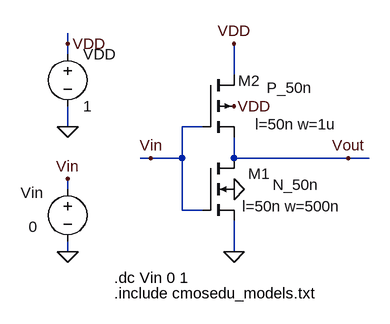
[diagram p0: schematic 1-NOT-DC.asc]
1-NOT-DC.asc, the LTspice schematic file:
Version 4
SHEET 1 1136 680
WIRE 192 -352 192 -368
WIRE 192 -336 192 -352
WIRE 448 -304 448 -352
WIRE 192 -224 192 -256
WIRE 400 -224 368 -224
WIRE 320 -176 304 -176
WIRE 368 -176 368 -224
WIRE 368 -176 320 -176
WIRE 448 -176 448 -208
WIRE 624 -176 448 -176
WIRE 656 -176 624 -176
WIRE 192 -128 192 -144
WIRE 368 -96 368 -176
WIRE 400 -96 368 -96
WIRE 192 -32 192 -48
WIRE 448 -32 448 -80
FLAG 192 -32 0
FLAG 624 -176 Vout
FLAG 192 -144 Vin
FLAG 448 -128 0
FLAG 192 -224 0
FLAG 192 -352 VDD
FLAG 448 -256 VDD
FLAG 448 -32 0
FLAG 448 -352 VDD
FLAG 320 -176 Vin
SYMBOL nmos4 400 -176 R0
WINDOW 0 104 24 Right 2
WINDOW 3 179 41 Right 2
WINDOW 123 213 74 Right 2
SYMATTR InstName M1
SYMATTR Value N_50n
SYMATTR Value2 l=50n w=500n
SYMBOL voltage 192 -144 R0
WINDOW 0 -72 21 Left 2
WINDOW 3 -60 74 Left 2
WINDOW 123 0 0 Left 2
WINDOW 39 0 0 Left 2
SYMATTR InstName Vin
SYMATTR Value 0
SYMBOL voltage 192 -352 R0
WINDOW 123 0 0 Left 2
WINDOW 39 0 0 Left 2
SYMATTR InstName VDD
SYMATTR Value 1
SYMBOL pmos4 400 -304 R0
WINDOW 0 88 9 Right 2
WINDOW 3 168 20 Right 2
WINDOW 123 206 76 Right 2
SYMATTR InstName M2
SYMATTR Value P_50n
SYMATTR Value2 l=50n w=1u
TEXT 264 8 Left 2 !.dc Vin 0 1
TEXT 264 32 Left 2 !.include cmosedu_models.txt

The netlist it stands for:
* 1-NOT-DC.asc
M1 Vout Vin 0 0 N_50n l=50n w=500n
Vin Vin 0 0
VDD VDD 0 1
M2 VDD Vin Vout VDD P_50n l=50n w=1u
.model NMOS NMOS
.model PMOS PMOS
.lib standard.mos
.dc Vin 0 1
.include cmosedu_models.txt
.backanno
.end